# Altium project NFC_3911_Project.PrjPcb
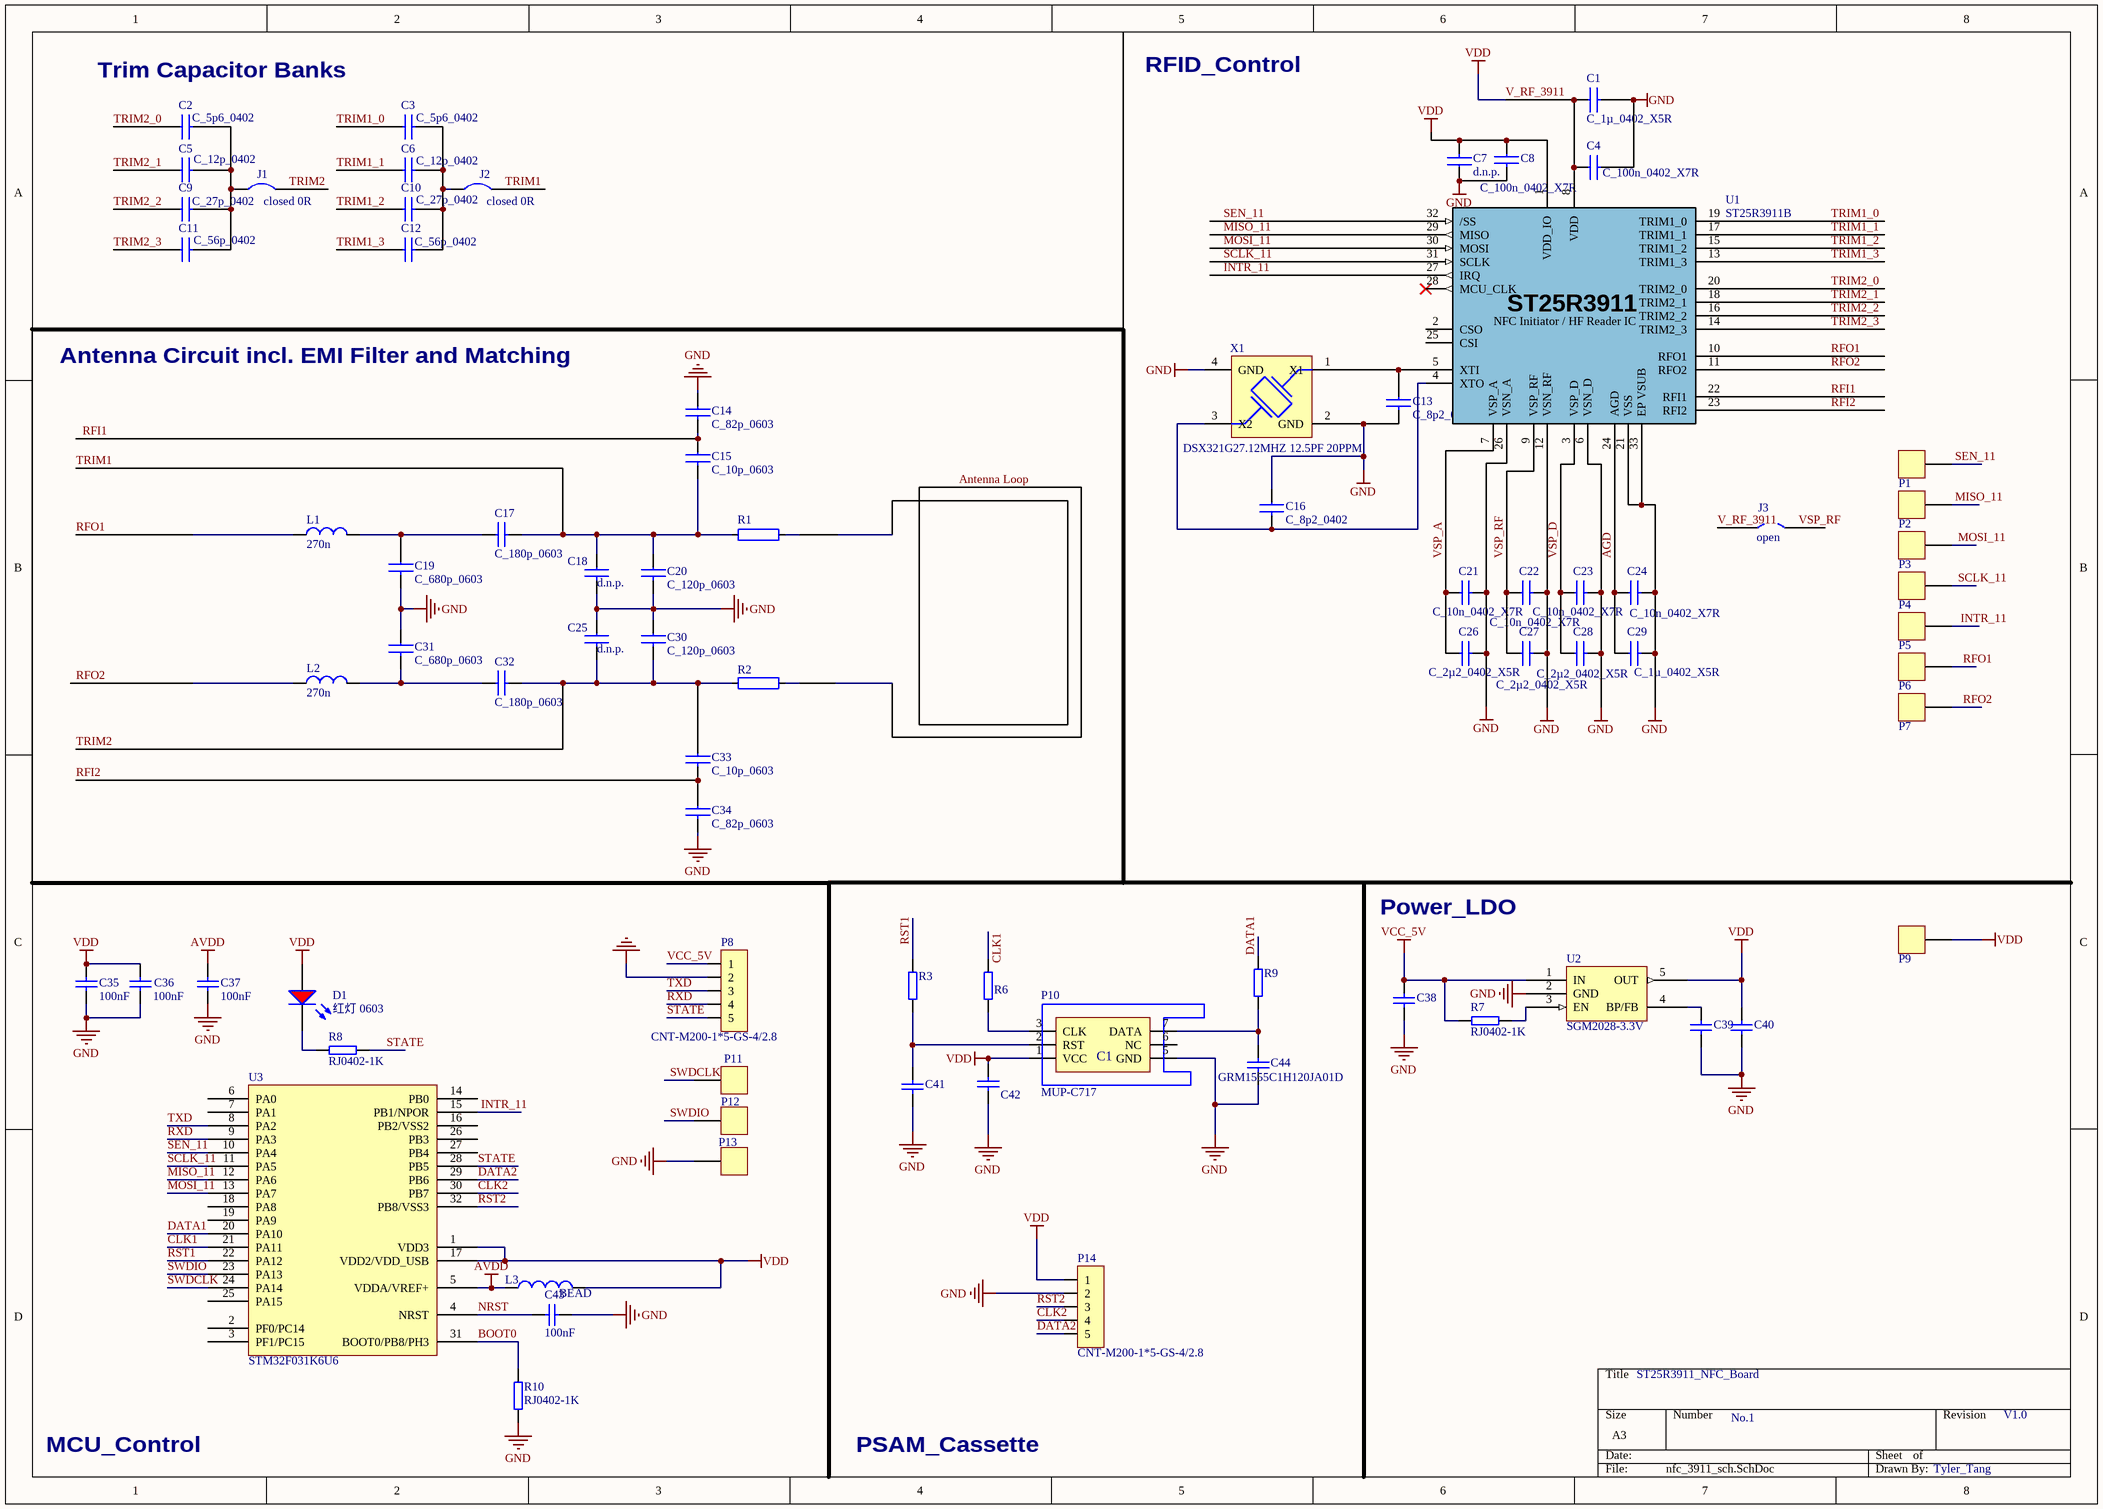
[diagram p0: nfc_3911_sch.SchDoc]
1 sheet, 77 parts. Net scope: global (net labels, ports and power ports of the same name join across sheets).
Board file: nfc_3911_pcb_1.PcbDoc

## Sheet nfc_3911_sch.SchDoc
size A3

### Parts
C1  C_1µ_0402_X5R  [0402_C]
C2  C_5p6_0402  [0402_C]
C3  C_5p6_0402  [0402_C]
C4  C_100n_0402_X7R  [0402_C]
C5  C_12p_0402  [0402_C]
C6  C_12p_0402  [0402_C]
C7  d.n.p.  [0402_C]
C8  C_100n_0402_X7R  [0402_C]
C9  C_27p_0402  [0402_C]
C10  C_27p_0402  [0402_C]
C11  C_56p_0402  [0402_C]
C12  C_56p_0402  [0402_C]
C13  C_8p2_0402  [0402_C]
C14  C_82p_0603  [0603_C]
C15  C_10p_0603  [0603_C]
C16  C_8p2_0402  [0402_C]
C17  C_180p_0603  [0603_C]
C18  d.n.p.  [0603_C]
C19  C_680p_0603  [0603_C]
C20  C_120p_0603  [0603_C]
C21  C_10n_0402_X7R  [0402_C]
C22  C_10n_0402_X7R  [0402_C]
C23  C_10n_0402_X7R  [0402_C]
C24  C_10n_0402_X7R  [0402_C]
C25  d.n.p.  [0603_C]
C26  C_2µ2_0402_X5R  [0402_C]
C27  C_2µ2_0402_X5R  [0402_C]
C28  C_2µ2_0402_X5R  [0402_C]
C29  C_1µ_0402_X5R  [0402_C]
C30  C_120p_0603  [0603_C]
C31  C_680p_0603  [0603_C]
C32  C_180p_0603  [0603_C]
C33  C_10p_0603  [0603_C]
C34  C_82p_0603  [0603_C]
C35  100nF  [0402_C]
C36  100nF  [0402_C]
C37  100nF  [0402_C]
C38  CAP-NP  [0402_C]  (value not drawn)
C39  CAP-NP  [0402_C]  (value not drawn)
C40  CAP-NP  [0402_C]  (value not drawn)
C41  CAP-NP  [0402_C]  (value not drawn)
C42  CAP-NP  [0402_C]  (value not drawn)
C43  100nF  [0402_C]
C44  产品型号: GRM1555C1H120JA01D  [0402C_0.4D]  (hidden comment: CAP-NP)
D1  红灯 0603  [0603_LED_S1]
J1  closed 0R  [0402_R]  (net tie)
J2  closed 0R  [0402_R]  (net tie)
J3  open  [0402_R]  (net tie, no BOM)
L1  270n  [0603_L]
L2  270n  [0603_L]
L3  BEAD  [0603]
P1  Hole  [TP1]  (value not drawn)
P2  Hole  [TP1]  (value not drawn)
P3  Hole  [TP1]  (value not drawn)
P4  Hole  [TP1]  (value not drawn)
P5  Hole  [TP1]  (value not drawn)
P6  Hole  [TP1]  (value not drawn)
P7  Hole  [TP1]  (value not drawn)
P8  产品型号: CNT-M200-1*5-GS-4/2.8  [SIP 2.0_5_S]  (hidden comment: SPI 5-M)
P9  Hole  [TP1]  (value not drawn)
P10  产品型号: MUP-C717  [SIM-MUP-C717]  (hidden comment: SIM-4)
P11  Hole  [TP1]  (value not drawn)
P12  Hole  [TP1]  (value not drawn)
P13  Hole  [TP1]  (value not drawn)
P14  产品型号: CNT-M200-1*5-GS-4/2.8  [SIP 2.0_5_S]  (hidden comment: SPI 5-M)
R1  3R9  [0603_R]  (value not drawn)
R2  3R9  [0603_R]  (value not drawn)
R3  RES  [0402R_0.4D]  (value not drawn)
R6  RES  [0402R_0.4D]  (value not drawn)
R7  产品型号: RJ0402-1K  [0402R_0.4D]  (hidden comment: RES)
R8  产品型号: RJ0402-1K  [0402R_0.4D]  (hidden comment: RES)
R9  RES  [0402R_0.4D]  (value not drawn)
R10  产品型号: RJ0402-1K  [0402R_0.4D]  (hidden comment: RES)
U1  ST25R3911B  [ST25R3911B]
U2  SGM2028-3.3V  [SGM2028-3.3]
U3  STM32F031K6U6  [STM32F031K6U6]
X1  产品型号: DSX321G27.12MHZ 12.5PF 20PPM  [2520]  (hidden comment: CRYSTAL-4P)

### Nets
AVDD: C37.1 L3.1 U3.5(VDDA/VREF+)
GND: C1.2 C4.2 C7.1 C8.2 C13.2 C14.1 C16.1 C18.2 C19.2 C20.2 C21.2 C22.2 C23.2 C24.2 C25.1 C26.2 C27.2 C28.2 C29.2 C30.1 C31.1 C34.2 C35.2 C36.2 C37.2 C38.1 C39.1 C40.1 C41.1 C42.2 C43.1 C44.1 P8.2 P10.5(GND) P13.1 P14.2 R10.2 U1.6(VSN_D) U1.12(VSN_RF) U1.21(VSS) U1.26(VSN_A) U1.33(EP_VSUB) U2.2(GND) X1.2(GND) X1.4(GND)
V_RF_3911: C1.1 C4.1 C7.2 C8.1 C35.1 C36.1 C40.2 C42.1 D1.A J3.1 L3.2 P9.1 P10.1(VCC) P14.1 U1.1(VDD_IO) U1.8(VDD) U2.5(OUT) U3.1(VDD3) U3.17(VDD2/VDD_USB)  [also labelled VDD]
VCC_5V: C38.2 P8.1 R7.1 U2.1(IN)
AGD: C24.1 C29.1 U1.24(AGD)
Antenna Loop: R1.1 R2.1
BOOT0: R10.1 U3.31(BOOT0/PB8/PH3)
CLK1: R6.1 U3.21(PA11)
CLK2: P14.4 U3.30(PB7)
DATA1: R9.2 U3.20(PA10)
DATA2: P14.5 U3.29(PB6)
INTR_11: P5.1 U1.27(IRQ) U3.15(PB1/NPOR)
MISO_11: P2.1 U1.29(MISO) U3.12(PA6)
MOSI_11: P3.1 U1.30(MOSI) U3.13(PA7)
NRST: C43.2 U3.4(NRST)
RFI1: C14.2 C15.1 U1.22(RFI1)
RFI2: C33.2 C34.1 U1.23(RFI2)
RFO1: L1.2 P6.1 U1.10(RFO1)
RFO2: L2.2 P7.1 U1.11(RFO2)
RST1: R3.2 U3.22(PA12)
RST2: P14.3 U3.32(PB8/VSS3)
RXD: P8.4 U3.9(PA3)
SCLK_11: P4.1 U1.31(SCLK) U3.11(PA5)
SEN_11: P1.1 U1.32(/SS) U3.10(PA4)
STATE: P8.5 R8.2 U3.28(PB5)
SWDCLK: P11.1 U3.24(PA14)
SWDIO: P12.1 U3.23(PA13)
TRIM1: C15.2 C17.2 C18.1 C20.1 J2.2 R1.2
TRIM1_0: C3.1 U1.19(TRIM1_0)
TRIM1_1: C6.1 U1.17(TRIM1_1)
TRIM1_2: C10.1 U1.15(TRIM1_2)
TRIM1_3: C12.1 U1.13(TRIM1_3)
TRIM2: C25.2 C30.2 C32.2 C33.1 J1.2 R2.2
TRIM2_0: C2.1 U1.20(TRIM2_0)
TRIM2_1: C5.1 U1.18(TRIM2_1)
TRIM2_2: C9.1 U1.16(TRIM2_2)
TRIM2_3: C11.1 U1.14(TRIM2_3)
TXD: P8.3 U3.8(PA2)
VSP_A: C21.1 C26.1 U1.7(VSP_A)
VSP_D: C23.1 C28.1 U1.3(VSP_D)
VSP_RF: C22.1 C27.1 J3.2 U1.9(VSP_RF)
NetC2_2: C2.2 C5.2 C9.2 C11.2 J1.1
NetC3_2: C3.2 C6.2 C10.2 C12.2 J2.1
NetC13_1: C13.1 U1.5(XTI) X1.1(X1)
NetC16_2: C16.2 U1.4(XTO) X1.3(X2)
NetC17_1: C17.1 C19.1 L1.1
NetC31_2: C31.2 C32.1 L2.1
NetC39_2: C39.2 U2.4(BP/FB)
NetC41_2: C41.2 P10.2(RST) R3.1
NetC44_2: C44.2 P10.7(DATA) R9.1
NetD1_K: D1.K R8.1
NetP10_3: P10.3(CLK) R6.2
NetR7_2: R7.2 U2.3(EN)

Not connected (* = marked no-connect by the designer): P10 6(NC); U1 2(CSO) 25(CSI) 28(MCU_CLK)*; U3 2(PF0/PC14) 3(PF1/PC15) 6(PA0) 7(PA1) 14(PB0) 16(PB2/VSS2) 18(PA8) 19(PA9) 25(PA15) 26(PB3) 27(PB4)

### Notes on the sheet
- (near C2) Trim Capacitor Banks
- RFID_Control
- Antenna Circuit incl. EMI Filter and Matching
- Power_LDO
- ST25R3911_NFC_Board
- MCU_Control
- PSAM_Cassette
- No.1
- V1.0
- Tyler_Tang
- (in symbol 1416000310) C1

### Library data of the parts
C1 C29 = C_1µ_0402_X5R: 1u_X5R; Manufacturer: MURATA; Manufacturer Part Number: GRM155R61C105KA12D; 2nd Source: 0402, 1 µF, 16 V, ± 10%, X5R,; Supplier 1: Farnell; Supplier Part Number 1: 2362093
C2 C3 = C_5p6_0402: 5p6_COG; Manufacturer: MURATA; Manufacturer Part Number: GRM1555C1H5R6DA01D; 2nd Source: 5,6pF ±0,5pF 50V  C0G, NP0 0402; Supplier 1: Digi-Key; Supplier Part Number 1: 490-5946-1-ND
C4 C8 = C_100n_0402_X7R: 100n_X7R; Manufacturer: MULTICOMP; Manufacturer Part Number: MC0402X104K100CT; 2nd Source: 0402, 0.1 µF, 10 V, ± 10%, X5R,; Supplier 1: Farnell; Supplier Part Number 1: 1759380
C5 C6 = C_12p_0402: 12p_COG; Manufacturer: MURATA; Manufacturer Part Number: GRM1555C1H120GA01D; 2nd Source: 12pF ±2% 50V  C0G, NP0 0402; Supplier 1: Digi-Key; Supplier Part Number 1: 490-6197-1-ND
C7 = C_0402
C9 C10 = C_27p_0402: 27p_COG; Manufacturer: MURATA; Manufacturer Part Number: GRM1555C1H270GA01D; 2nd Source: 27pF ±2% 50V  C0G, NP0 0402; Supplier 1: Digi-Key; Supplier Part Number 1: 490-6224-1-ND
C11 C12 = C_56p_0402: 56p_COG; Manufacturer: MURATA; Manufacturer Part Number: GRM1555C1H560GA01D; 2nd Source: 56pF ±2% 50V  C0G, NP0 0402; Supplier 1: Digi-Key; Supplier Part Number 1: 490-6247-1-ND
C13 C16 = C_8p2_0402: 8p2_COG; Manufacturer: MURATA; Manufacturer Part Number: GRM1555C1H8R2CA01D; 2nd Source: 0402, 8.2 pF, 50 V, ± 0.25pF, C0G / NP0; Supplier 1: Farnell; Supplier Part Number 1: 1828874
C14 C34 = C_82p_0603: 82p_COG; Manufacturer: MURATA; Manufacturer Part Number: GRM1885C1H820FA01D; 2nd Source: 82pF ±1% 50V  C0G, NP0 0603; Supplier 1: Digi-Key; Supplier Part Number 1: 490-10724-1-ND
C15 C33 = C_10p_0603: 10p_COG; Manufacturer: MULTICOMP; Manufacturer Part Number: MC0603N100F500CT; 2nd Source: 0603, 10pF, 50 V, 1%, C0G / NP0; Supplier 1: Farnell; Supplier Part Number 1: 2410381
C17 C32 = C_180p_0603: 180p_COG; Manufacturer: MURATA; Manufacturer Part Number: GRM1885C1H181GA01D; 2nd Source: 180pF ±2% 50V  C0G, NP0 0603; Supplier 1: Digi-Key; Supplier Part Number 1: 490-11450-1-ND
C18 C25 = C_0603
C19 C31 = C_680p_0603: 680p_COG; Manufacturer: MURATA; Manufacturer Part Number: GRM1885C1H681GA01D; 2nd Source: 680pF ±2% 50V  C0G, NP0 0603; Supplier 1: Digi-Key; Supplier Part Number 1: 490-11476-1-ND
C20 C30 = C_120p_0603: 120p_COG; Manufacturer: MURATA; Manufacturer Part Number: GRM1885C1H121GA01D; 2nd Source: 120pF ±2% 50V  C0G, NP0 0603; Supplier 1: Digi-Key; Supplier Part Number 1: 490-12712-1-ND
C21-C24 = C_10n_0402_X7R: 10n_x7R; Manufacturer: AVX; Manufacturer Part Number: 04023C103KAT2A; 2nd Source: 0402, 0.01 µF, 25 V, ± 10%, X7R; Supplier 1: Farnell; Supplier Part Number 1: 1327624
C26-C28 = C_2µ2_0402_X5R: 2u2_X5R; Manufacturer: MURATA; Manufacturer Part Number: GRM155R60J225ME15D; 2nd Source: 0402, 2.2 µF, 6.3 V, ± 20%, X5R; Supplier 1: Farnell; Supplier Part Number 1: 2362088
C35-C37 = Cap: Capacitor; Value: 10nF; Published: 8-Jun-2000; Revision: July-2002: Re-released for DXP Platform.; Publisher: Altium Limited
C38 C39 = 1405000354: 1uF/6.3V/10%/X5R; 产品型号: GRM155R60J105KE19D; 器件名称: 陶瓷电容; 原厂品牌: MURATA; 封装: 0402; 存货编码: 1405000354
C40 = 1405000727: 10nF/25V/10%/X7R; 产品型号: GRM155R71E103KA01D; 器件名称: 陶瓷电容; 原厂品牌: MURATA; 封装: 0402; 存货编码: 1405000727
C41 C42 = 1405000357: 0.1uF/16V/10%/X5R; 产品型号: CC0402KRX5R7BB104; 器件名称: 陶瓷电容; 原厂品牌: YAGEO; 封装: 0402; 存货编码: 1405000357
C43 = CAP: Capacitor; Value: 100pF; Published: 8-Jun-2000; Revision: July-2002: Re-released for DXP Platform.; Publisher: Altium Limited
C44 = 1405000181: 12pF/50V/5%/C0G; 器件名称: 陶瓷电容; 原厂品牌: MURATA; 封装: 0402; 存货编码: 1405000181
D1 = 0603 红灯: 发光二极管; ComponentLink1Description: 供应商链接; ComponentLink1URL: http://www.szlcsc.com/product/details_2659.html; Package: 0603; Supplier: LC; SuppliersPartNumber: C2286
J1 J2 = solder_jumper_closed: 0R; Manufacturer: Multicomp; Manufacturer Part Number: MC00625W040210R; Supplier 1: Farnell; Supplier Part Number 1: 1357983
J3 = solder_jumper_open
L1 L2 = L0603_270nH: Manufacturer: MURATA; Manufacturer Part Number: LQW18ANR27G80D; 2nd Source: "270nH Unshielded Wirewound Inductor 260mA 2.42 Ohm Max 0603, SFR@1,25GHz, Q>24@100MHz"; Supplier 1: Digi-Key; Supplier Part Number 1: 490-13392-2-ND
L3 = Inductor: Value: 100uH; Published: 8-Jun-2000; Revision: July-2002: Re-released for DXP Platform.; Publisher: Altium Limited
P8 P14 = 1416000091: 2.00mm/1*5P/单排/直/PA=4/PC=2.8; 器件名称: 排针; 原厂品牌: 肯耐特; 封装: DIP; 存货编码: 1416000091
P10 = 1416000310: SIM卡座; 器件名称: 卡座; 原厂品牌: 德海威; 封装: SMD; 存货编码: 1416000310
R1 R2 = R0603_3R9: 3R9, 0603; Manufacturer: Panasonic; Manufacturer Part Number: ERJ-3GEYJ3R9V; 2nd Source: 3.9 Ohm ±5% 0.1W, 1/10W Chip Resistor 0603; Supplier Part Number 1: P3.9GCT-ND; Supplier 1: Digi-Key
R3 R6 R9 = 1408000466: 33R/5%/100PPM; 产品型号: RC0402JR-0733RL; 器件名称: 电阻; 原厂品牌: YAGEO; 封装: 0402; 存货编码: 1408000466
R7 R8 R10 = 1408000535: 1K/5%/100PPM; 器件名称: 电阻; 原厂品牌: Uniohm; 封装: 0402; 存货编码: 1408000535
U1 = ST25R3911: NFC Initiator / HF Reader IC; Manufacturer: STMicroelectronics; Manufacturer Part Number: ST25R3911B-AQFMCT-ND; ST or Subco proc: delivered by ST; Supplier 1: Digi-Key; Supplier Part Number 1: ST25R3911B-AQFMCT-ND
U2 = SGM2028
U3 = MCU_LQFP32
X1 = 1413000276: 10pF/40MHz/10PPM/60Ωmax/-40°~85°; 器件名称: 晶振; 原厂品牌: YOKE友桂; 存货编码: 1413000276; 封装: 2520